# EAGLE design Puzzle - IR distance interrupter (EAGLE 6.2)
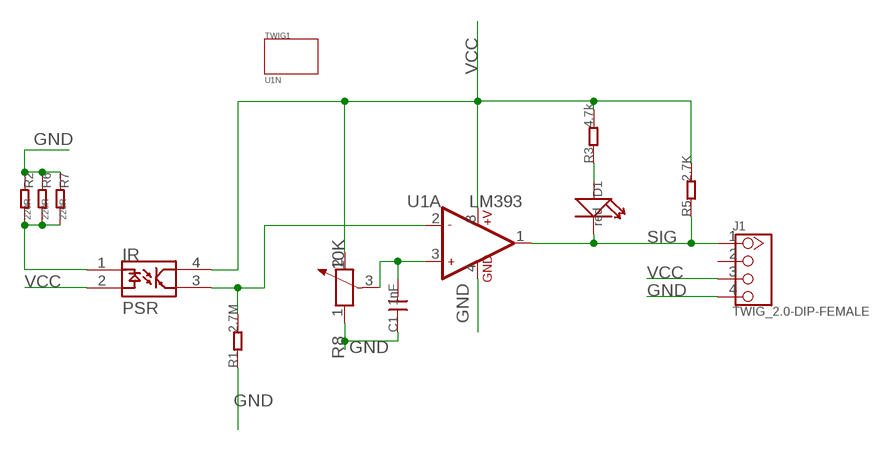
[diagram p0: schematic, sheet 1]

## Parts
C1  1nF  C-0603  [0603]
D1  red  007-LED35*40  [LED0603]
J1  TWIG_2.0-DIP-FEMALE  [2.0_1X4]
PSR  PSR  [PSR]
R1  2.7M  005-R0603_S  [0603_S]
R2  220R  R-0805  [0805]
R3  4.7k  005-R0603_S  [0603_S]
R5  2.7K  005-R0603_S  [0603_S]
R6  220R  R-0805  [0805]
R7  220R  R-0805  [0805]
R8  10K  R-POTENTIOMETER'3362'  [3P-SQUA-7X6.8]
TWIG1  U1N  [U1N]
U1  LM393  LMV358  [SO08]

## Nets
GND: C1.1 J1.4 R1.1 R2.1 R6.1 R7.1 R8.1 U1.4(A:GND)
N$1: C1.2 R8.3 U1.3(A:+IN1)
N$2: D1.1(+) R3.1
N$4: PSR.3 R1.2 U1.2(A:-IN1)
N$6: PSR.1 R2.2 R6.2 R7.2
SIG: D1.2(-) J1.1 R5.1 U1.1(A:OUT1)
VCC: J1.3 PSR.2 PSR.4 R3.2 R5.2 R8.2 U1.8(A:+V)
Unconnected: J1.2 U1.5(B:+IN2) U1.6(B:-IN2) U1.7(B:OUT2)

## Library data of the parts
C1 = Discrete:C*: Ceramic Capacitors
D1 = Discrete:007-LED*
J1 = Connector:TWIG_2.0-DIP-FEMALE
PSR = IR:PSR*
R1 R3 R5 = Discrete:005-R*
R2 R6 R7 = Discrete:R*
R8 = Discrete:R-POTENTIOMETER*: Potentiometer
TWIG1 = EXT_moudle:U1N
U1 = IC:LMV358: General purpose LOW Voltage, Rail-to-Rail Output Amplifiers http://www.fairchildsemi.com/ds/LM/LMV358.pdf

## Board
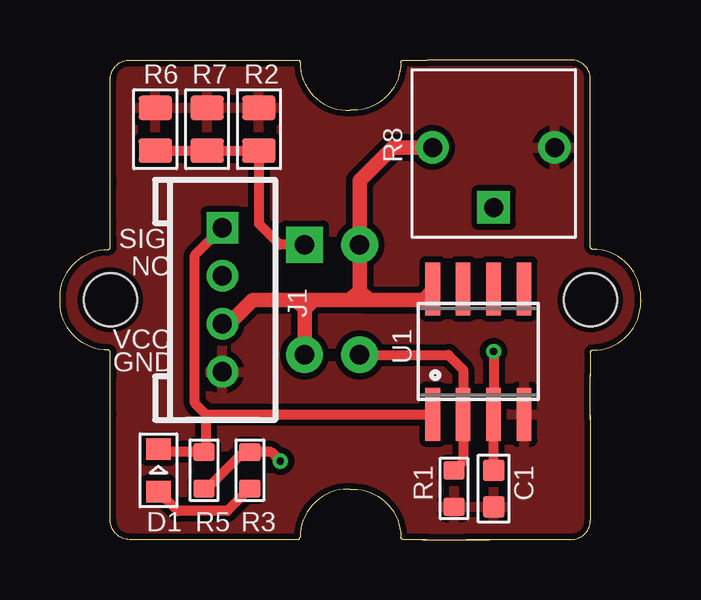
[diagram p1: board, top side]
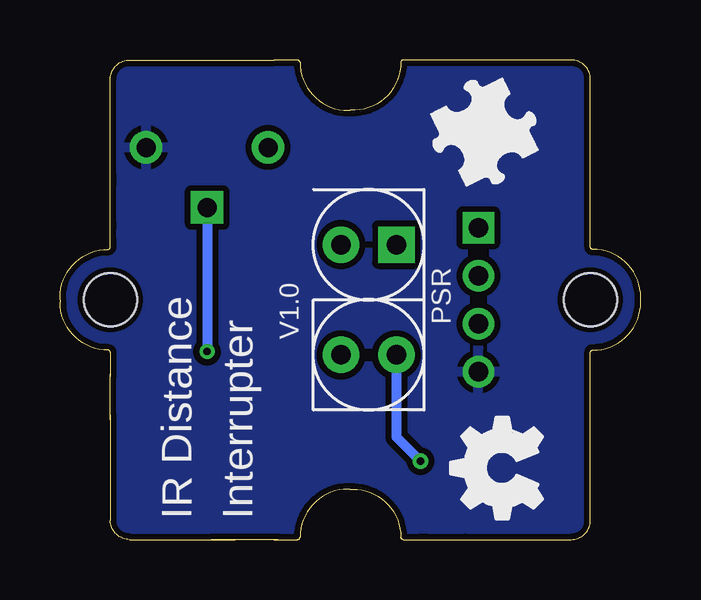
[diagram p2: board, bottom side, seen from below]

Size 24.2 x 20 mm. Coordinates in mm from the lower left corner, seen from the top.
Copper layers (1*16): Top 0.035mm / dielectric 1.5mm / Bottom 0.035mm
Design rules: minimum track width 8mil, minimum drill 12mil, track to track 8mil, track to pad 8mil, pad to pad 8mil, via to via 8mil, smd to smd 0mil, copper to edge 10mil, drill to drill 10mil, minimum pad ring 10mil, minimum via ring 6mil, stop-mask expansion 2mil, vias tented up to drill 100mil, thermal gap 10mil

### Footprints (pad centres in the part's own frame; a part is rotated, then mirrored left to right if it is on the bottom)
0603 = smd 0.889 x 0.889: 1 -0.762,0; 2 0.762,0
LED0603 = smd 0.889 x 1.016: 1 -0.889,0; 2 0.889,0
2.0_1X4 = drill 0.8 pad 1.27 square: 1 -3,0 | drill 0.8 pad 1.27: 2 -1,0; 3 1,0; 4 3,0
PSR = drill 0.813 pad 1.524 square: 1 -2.3,1.15 | drill 0.813 pad 1.524: 2 -2.3,-1.15; 3 2.3,-1.15; 4 2.3,1.15
0603_S = smd 0.762 x 0.889: 1 -0.762,0; 2 0.762,0
0805 = smd 1.016 x 1.397: 1 -0.889,0; 2 0.889,0
3P-SQUA-7X6.8 = drill 0.8 pad 1.35: 1 -2.54,-0.25; 2 2.54,-0.25 | drill 0.8 pad 1.35 square: 3 0,2.25
U1N = hole 2.2: 0,-10; 0,10
SO08 = smd 0.61 x 2.21: 1 -1.905,-2.616; 2 -0.635,-2.616; 3 0.635,-2.616; 4 1.905,-2.616; 5 1.905,2.616; 6 0.635,2.616; 7 -0.635,2.616; 8 -1.905,2.616

### Placement (x,y rotation side)
C1  18.07,2.13 90 top
D1  4.1,2.89 90 top
J1  6.77,10 270 top
PSR  11.34,10 270 bottom
R1  16.42,2.13 90 top
R2  8.29,17.11 270 top
R3  7.91,2.89 90 top
R5  6,2.89 270 top
R6  3.97,17.11 270 top
R7  6.13,17.11 270 top
R8  18.07,16.1 180 top
TWIG1  12.1,10 90 top
U1  17.43,7.84 0 top
U$1  [OSHW_FILLX150_NOTEXT]  4.1,0.86 90 bottom
U$2  [BRICK-LOGO-MIL-0.5]  9.05,14.44 0 bottom

### Tracks (layer width: path | path; a pad name or v marks a point on that pad's centre or on a via)
GND
  pour Top (isolate 0.254): -0.98,20.54 24.42,20.54 24.42,-0.41 -0.98,-0.41
  pour Bottom (isolate 0.254): -0.98,20.54 24.42,20.54 24.42,-0.41 -0.98,-0.41
N$1  (via drill 0.3 pad 0.64)
  Top 0.406: C1.2 U1.3 v18.07,7.84
  Bottom 0.406: R8.3 v18.07,7.84
N$2
  Top 0.406: R3.1 6.97,1.19 4.91,1.19 D1.1
N$4
  Top 0.406: R1.2 16.8,3.27 U1.2 16.8,7.08 16.18,7.7 PSR.3
N$6
  Top 0.406: R6.2 R7.2 R2.2 8.29,13.18 9.18,12.29 9.19,12.3 PSR.1
SIG
  Top 0.406: 6.08,5.23 5.62,5.68 5.62,11.86 J1.1 | 6.08,5.23 U1.1 | D1.2 4.23,3.65 R5.1 6.08,3.73 6.08,4.9 | 6.08,5.23 6.08,4.9 | 6.08,4.9 6.08,5 6.26,5.17
  Bottom 0.406: 6.77,12.92 J1.1
VCC  (via drill 0.3 pad 0.64)
  Top 0.406: R5.2 6.13,2.13 7.65,3.65 R3.2 8.8,3.65 v9.18,3.27
  Top 0.61: J1.3 7.04,9 8.04,10 9.81,10 | 9.81,10 10.32,10 | 12.61,10 15.15,10 | 15.15,10 15.4,10 | 15.4,10 15.53,9.87 15.53,10 | 15.53,10 15.53,10.38 | PSR.4 10.19,9.61 | 10.19,9.63 10.19,9.87 10.32,10 | R8.2 13.87,16.35 12.49,14.96 PSR.2 12.49,10.39 | 12.49,10.37 12.49,10.12 12.61,10 | 12.49,10.39 12.23,10.13 12.73,10.13 12.49,10.37 | 12.49,10.39 12.49,10.37 | 12.61,10 10.58,10 | 10.19,9.61 10.19,9.63 | 10.19,9.63 9.81,10 | 10.19,9.61 10.58,10 | 10.58,10 10.32,10 | 15.53,10.51 U1.8 15.53,10.38 | 15.53,10.38 15.15,10 | 15.4,10 15.53,10
  Bottom 0.406: PSR.4 10.19,4.28 v9.18,3.27

### Text on the board
tPlace: SIG | NC | VCC | GND
bPlace: V1.0 | Interrupter | IR Distance